# Altium project CAN-Box Reverse.PrjPcb
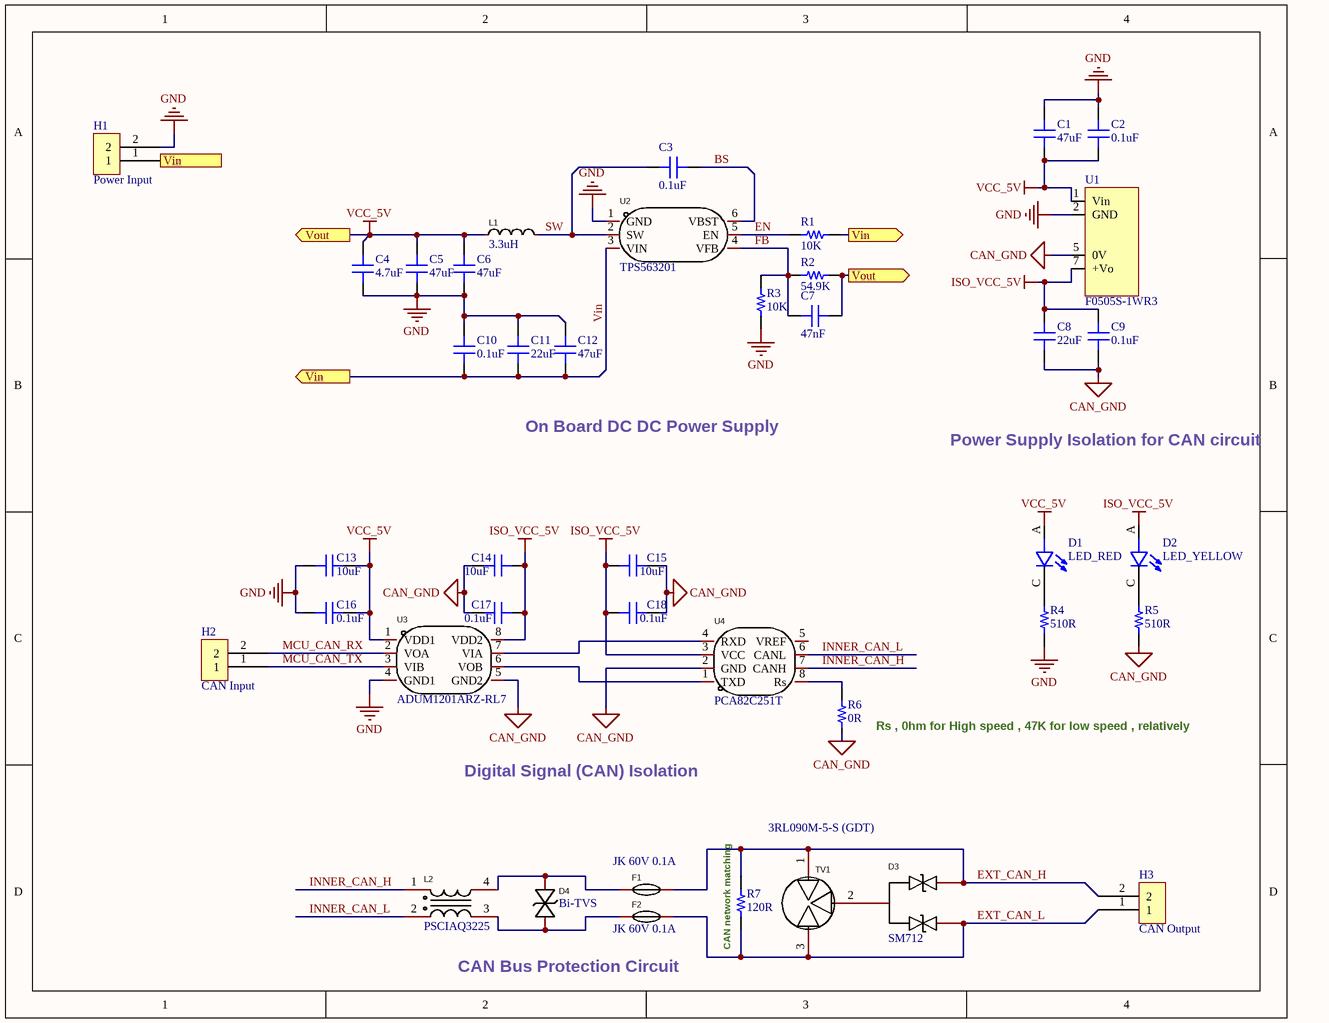
[diagram p0: Integrate.SchDoc]
1 sheet, 41 parts. Net scope: flat (ports and power ports of the same name join across sheets).
Board file: Integrate.PcbDoc

## Sheet Integrate.SchDoc
size A

### Parts
C1  47uF  [1206_C]
C2  0.1uF  [0402_C]
C3  0.1uF  [0402_C]
C4  4.7uF  [0402_C]
C5  47uF  [1206_C]
C6  47uF  [1206_C]
C7  47nF  [0402_C]
C8  22uF  [0805_C]
C9  0.1uF  [0402_C]
C10  0.1uF  [0402_C]
C11  22uF  [0805_C]
C12  47uF  [1206_C]
C13  10uF  [0603_C]
C14  10uF  [0603_C]
C15  10uF  [0603_C]
C16  0.1uF  [0402_C]
C17  0.1uF  [0402_C]
C18  0.1uF  [0402_C]
D1  LED_RED  [0603_LED]
D2  LED_YELLOW  [0603_LED]
D3  SM712  [SOT-23-3]
D4  Bi-TVS  [SMA-BI]
F1  JK 60V 0.1A  [F1206]
F2  JK 60V 0.1A  [F1206]
H1  Power Input  [CONNECT_PAD]
H2  CAN Input  [CONNECT_PAD]
H3  CAN Output  [CONNECT_PAD]
L1  3.3uH  [IND-SMD_L3.5-W3.2]
L2  PSCIAQ3225  [FILTER-SMD_4P]
R1  10K  [0402_R]
R2  54.9K  [0402_R]
R3  10K  [0402_R]
R4  510R  [0402_R]
R5  510R  [0402_R]
R6  0R  [0402_R]
R7  120R  [0603_R]
TV1  3RL090M-5-S (GDT)  [DIO-DT-SMD]
U1  F0505S-1WR3  [F_S-1WR3]
U2  TPS563201  [SOT-23-6]
U3  ADUM1201ARZ-RL7  [SOP-8]
U4  PCA82C251T  [SOP-8]

### Ports
Vin (in), Vin (out), Vout (out)

### Nets
CAN_GND: C8.2 C9.1 C14.1 C15.1 C17.1 C18.1 R5.1 R6.1 U1.5(0V) U3.5(GND2) U4.2(GND)
GND: C1.1 C2.2 C4.1 C5.1 C6.1 C10.2 C11.2 C12.2 C13.1 C16.1 H1.2 R3.1 R4.1 U1.2(GND) U2.1(GND) U3.4(GND1)
ISO_VCC_5V: C8.1 C9.2 C14.2 C15.2 C17.2 C18.2 D2.A U1.7(+Vo) U3.8(VDD2) U4.3(VCC)
VCC_5V: C1.2 C2.1 C4.2 C5.2 C6.2 C7.2 C13.2 C16.2 D1.A L1.1 R2.2 U1.1(Vin) U3.1(VDD1) ; port Vout
BS: C3.2 U2.6(VBST)
EN: R1.1 U2.5(EN)
EXT_CAN_H: D3.1 F1.2 H3.2 R7.2 TV1.1
EXT_CAN_L: D3.2 F2.2 H3.1 R7.1 TV1.3
FB: C7.1 R2.1 R3.2 U2.4(VFB)
INNER_CAN_H: L2.1 U4.7(CANH)
INNER_CAN_L: L2.2 U4.6(CANL)
MCU_CAN_RX: H2.2 U3.2(VOA)
MCU_CAN_TX: H2.1 U3.3(VIB)
SW: C3.1 L1.2 U2.2(SW)
Vin: C10.1 C11.1 C12.1 H1.1 R1.2 U2.3(VIN) ; port Vin
NetD1_C: D1.C R4.2
NetD2_C: D2.C R5.2
NetD3_3: D3.3 TV1.2
NetD4_1: D4.1(C) F2.1 L2.3
NetD4_2: D4.2(A) F1.1 L2.4
NetR6_2: R6.2 U4.8(Rs)
NetU3_6: U3.6(VOB) U4.1(TXD)
NetU3_7: U3.7(VIA) U4.4(RXD)

Not connected (* = marked no-connect by the designer): U4 5(VREF)

### Notes on the sheet
- On Board DC DC Power Supply
- Power Supply Isolation for CAN circuit
- Digital Signal (CAN) Isolation
- (near R6) Rs , 0hm for High speed , 47K for low speed , relatively
- CAN Bus Protection Circuit
- (near R7) CAN network matching
- Title
- Size:
- Date:
- A
- Number:
- Time:
- Revision:
- Sheet
- of
- File:

### Library data of the parts
C1 C5 C6 C12 = C1206: SMT Capacitor
C2-C4 C7 C9 C10 C16-C18 = C0402: SMT Capacitor
C8 C11 = C0805: SMT Capacitor
C13-C15 = C0603: SMT Capacitor
D1 D2 = LED_0603: CHIP LED WHITE 0603 TOP VIEW; MP: LTW-C191TLA; Package: None; Availability: Unavailable; Value: *; Price: None
D3 = SM712: Dual channel ESD discharger; Manufacturer: TECH PUBLIC(台舟); Symbol: SM712_C521963; Add into BOM: yes; Name: SM712; Device: SM712_C521963; LCSC Part Name: SM712; Supplier Part: C521963; Manufacturer Part: SM712; Supplier Footprint: SOT-23; JLCPCB Part Class: Extended Part; Datasheet: https://atta.szlcsc.com/upload/public/pdf/source/20210810/E76C7C1824B0CB2A5B8963B3ABCE2DCE.pdf; Supplier: LCSC; Convert to PCB: yes
D4 = SMAJ13CA: Bidirectional TVS; Manufacturer: Slkor(萨科微); Symbol: SMAJ13CA_C513473; Add into BOM: yes; Polarity: 双向; Reverse Stand-Off Voltage (Vrwm): 13V; Breakdown Voltage: 14.4V; Peak Pulse Current (Ipp)@10/1000μs: 18.6A; Maximum Clamping Voltage: 21.5V; Name: SMAJ13CA; Device: SMAJ13CA_C513473; LCSC Part Name: 双向 Vrwm:13V; Supplier Part: C513473; Manufacturer Part: SMAJ13CA; Supplier Footprint: SMA; JLCPCB Part Class: Extended Part; Datasheet: https://atta.szlcsc.com/upload/public/pdf/source/20200414/C513473_E63E0FD439519C3FF443B186760FCA0C.pdf; Supplier: LCSC; Convert to PCB: yes
F1 F2 = JK-nSMD010/60V: Resettable Fuse; Manufacturer: JK(金科); Add into BOM: yes; Name: JK-nSMD010/60V; Symbol: JK-NSMD010/60V; Device: JK-nSMD010/60V; LCSC Part Name: 100mA 60V; Supplier Part: C2830236; Manufacturer Part: JK-nSMD010/60V; Supplier Footprint: SMD1206; JLCPCB Part Class: Extended Part; Datasheet: https://atta.szlcsc.com/upload/public/pdf/source/20210427/C2830251_B9511B640A50AD6A91174E2DDDD254CA.pdf; Supplier: LCSC; Convert to PCB: yes
H1-H3 = Connector-2: Two pin connector.
L1 = TMPC0302H-3R3MG: SMD power inductor 3.3uH; Manufacturer: TAI-TECH(台庆); Add into BOM: yes; Tolerance: ±20%; Rated Current: 3A; DC Resistance (DCR): 125mΩ; Name: 3.3uH; Symbol: TMPC0302H-3R3MG; Device: TMPC0302H-3R3MG; LCSC Part Name: 3.3uH ±20% 3A 125mΩ; Supplier Part: C305200; Manufacturer Part: TMPC0302H-3R3MG; Supplier Footprint: SMD; JLCPCB Part Class: Extended Part; Datasheet: https://atta.szlcsc.com/upload/public/pdf/source/20200917/C305200_025B938FDDD8216CB9AF20170083C431.pdf; Supplier: LCSC; Convert to PCB: yes; Value: 3.3uH
L2 = PSCIAQ3225-101Z: Common mode choke - 5.1KOhm @ 10Mhz; Manufacturer: PROD(谱罗德); Add into BOM: yes; Number of Lines: 2; Impedance @ Frequency: 5.1kΩ@10MHz; Inductance @ Frequency: 100uH@100kHz; Current Rating: 150mA; DC Resistance (DCR): 1.5Ω; Voltage Rating - DC: 80V; Voltage Rating: 80VAC; Name: PSCIAQ3225-101Z; Symbol: PSCIAQ3225-101Z; Device: PSCIAQ3225-101Z; LCSC Part Name: 两路 1210共模滤波器 阻抗5.1kΩ@10MHz; Supplier Part: C3011568; Manufacturer Part: PSCIAQ3225-101Z; Supplier Footprint: 1210; JLCPCB Part Class: Extended Part; Datasheet: https://atta.szlcsc.com/upload/public/pdf/source/20221209/0F115E7BC87283E32C2A7BCB65AC9CDC.pdf; Supplier: LCSC; Convert to PCB: yes; Operating Temperature: -25℃~+105℃; Withstanding Voltage: 80V
R1-R6 = R0402: SMT Resistor
R7 = R0603: SMT Resistor
TV1 = 3RL090M-5-S: Gas Discharge Tube; Manufacturer: Brightking(君耀电子); Add into BOM: yes; Number of Poles: 3; DC Spark-over Voltage: 90V; Tolerance: ±20%; Nominal Impulse Discharge Current: 5kA; Maximum Capacitance @ 1MHz: 2pF; Name: 3RL090M-5-S; Symbol: 3RL090M-5-S; Device: 3RL090M-5-S; LCSC Part Name: 90V 5kA 3端贴片GDT; Supplier Part: C78322; Manufacturer Part: 3RL090M-5-S; Supplier Footprint: SMD,5x6.6mm; JLCPCB Part Class: Extended Part; Datasheet: https://atta.szlcsc.com/upload/public/pdf/source/20160709/1468031850741.pdf; Supplier: LCSC; Convert to PCB: yes
U1 = F0505S-1WR3: MORNSUN Isolation Power supply
U2 = TPS563201: DCDC In 4.5V~17V Out 768mV~7V 3A; Manufacturer: TI(德州仪器); Name: TPS563201DDCR; Add into BOM: yes; Function: 降压型; Synchronous Rectification: 是; Output Type: 可调; Number of Outputs: 1; Topology: 降压式; Switching Frequency: 580kHz; Symbol: TPS563201DDCR; Device: TPS563201DDCR; LCSC Part Name: 降压型 Vin=4.5V~17V Vout=768mV~7V 3A; Supplier Part: C116592; Manufacturer Part: TPS563201DDCR; Supplier Footprint: SOT-23-Thin-6; JLCPCB Part Class: Extended Part; Datasheet: https://atta.szlcsc.com/upload/public/pdf/source/20170707/1499421477081.pdf; Supplier: LCSC; Convert to PCB: yes; Input Voltage: 4.5V~17V; Output Voltage: 768mV~7V; Output Current (Max): 3A; Operating Temperature: -40℃~+125℃@(TJ)
U3 = ADUM1201ARZ: Digital Isolator; Manufacturer: ADI(亚德诺)/LINEAR(凌特); Add into BOM: yes; Isolation Technology: 磁隔离; Number of Channels: 2; Forward Channel: 1; Voltage Isolation or Not: 带电压隔离; Isolation voltage: 2500Vrms; Data Rate: 1Mbps; Supply Voltage: 2.7V~5.5V; Name: ADUM1201ARZ-RL7; Symbol: ADUM1201ARZ-RL7; Device: ADUM1201ARZ-RL7; LCSC Part Name: ADUM1201ARZ-RL7; Supplier Part: C9669; Manufacturer Part: ADUM1201ARZ-RL7; Supplier Footprint: SOIC-8; JLCPCB Part Class: Basic Part; Datasheet: https://atta.szlcsc.com/upload/public/pdf/source/20121103/1457706544769.pdf; Supplier: LCSC; Convert to PCB: yes; Applications: 通用; Reverse channel: 1; Operating Temperature: -55℃~+100℃
U4 = PCA82C251: CAN transceiver; Manufacturer: Tokmas(托克马斯); Add into BOM: yes; Name: PCA82C251T; Symbol: PCA82C251T; Device: PCA82C251T; LCSC Part Name: PCA82C251T; Supplier Part: C7432796; Manufacturer Part: PCA82C251T; Supplier Footprint: SOP-8; Datasheet: https://atta.szlcsc.com/upload/public/pdf/source/20230625/276DDB82A8AA19CE4785C79DB2491288.pdf; Supplier: LCSC; Convert to PCB: yes; link: https://atta.szlcsc.com/upload/public/pdf/source/20230621/1484E0AD24B83654AF18D5B601DFC963.pdf